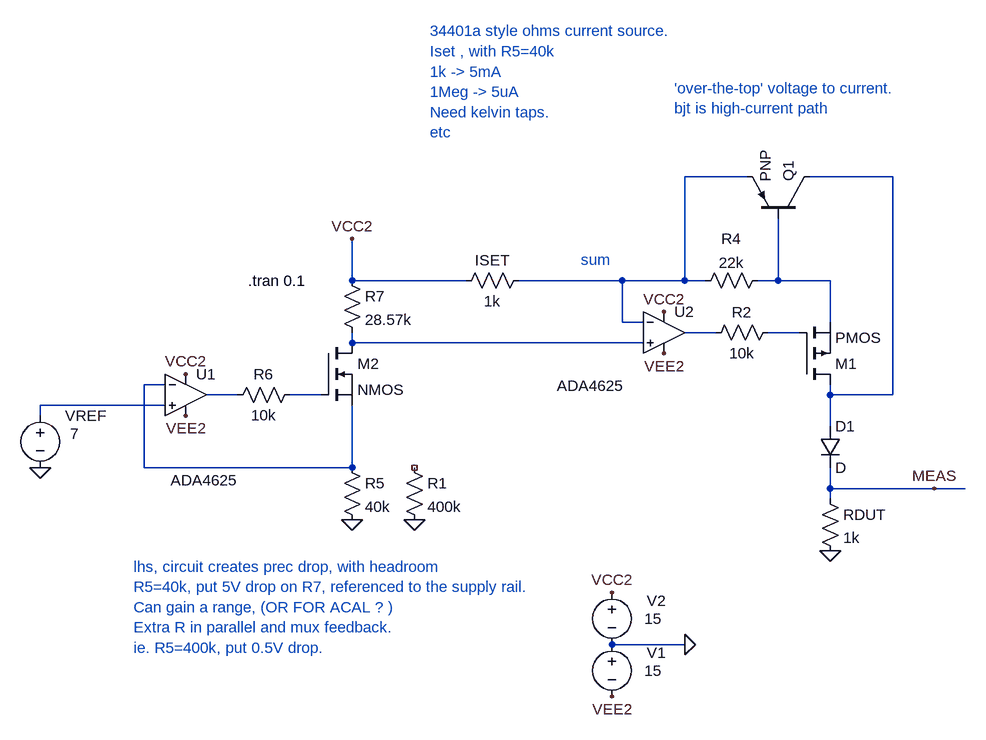
[diagram p0: schematic Draft16.asc]
Draft16.asc, the LTspice schematic file:
Version 4
SHEET 1 1768 872
WIRE 544 -144 448 -144
WIRE 768 -144 640 -144
WIRE -64 16 -64 -48
WIRE 112 16 -64 16
WIRE 352 16 192 16
WIRE 448 16 448 -144
WIRE 448 16 352 16
WIRE 480 16 448 16
WIRE 592 16 592 -80
WIRE 592 16 560 16
WIRE 672 16 592 16
WIRE 352 80 352 16
WIRE 384 80 352 80
WIRE 672 80 672 16
WIRE 496 96 448 96
WIRE 624 96 576 96
WIRE -64 112 -64 96
WIRE 384 112 -64 112
WIRE -64 128 -64 112
WIRE -352 176 -384 176
WIRE -240 192 -288 192
WIRE -112 192 -160 192
WIRE 672 192 672 176
WIRE 768 192 768 -144
WIRE 768 192 672 192
WIRE -352 208 -544 208
WIRE -544 224 -544 208
WIRE 672 240 672 192
WIRE -384 304 -384 176
WIRE -64 304 -64 208
WIRE -64 304 -384 304
WIRE 672 336 672 304
WIRE 832 336 672 336
WIRE 880 336 832 336
WIRE 672 352 672 336
WIRE 448 576 336 576
FLAG 448 576 0
FLAG 336 656 VEE2
FLAG 336 496 VCC2
FLAG 416 128 VEE2
FLAG 416 64 VCC2
FLAG -320 224 VEE2
FLAG -320 160 VCC2
FLAG -544 304 0
FLAG -64 384 0
FLAG -64 -48 VCC2
FLAG 672 432 0
FLAG 832 336 MEAS
FLAG 32 384 0
SYMBOL voltage 336 560 R0
WINDOW 0 54 29 Left 2
WINDOW 3 50 56 Left 2
WINDOW 123 0 0 Left 0
WINDOW 39 0 0 Left 0
SYMATTR InstName V1
SYMATTR Value 15
SYMBOL res 656 336 R0
SYMATTR InstName RDUT
SYMATTR Value 1k
SYMBOL res 208 0 R90
WINDOW 0 0 56 VBottom 2
WINDOW 3 32 56 VTop 2
SYMATTR InstName ISET
SYMATTR Value 1k
SYMBOL pmos 624 176 M180
SYMATTR InstName M1
SYMBOL voltage 336 480 R0
WINDOW 0 54 29 Left 2
WINDOW 3 50 56 Left 2
WINDOW 123 0 0 Left 0
WINDOW 39 0 0 Left 0
SYMATTR InstName V2
SYMATTR Value 15
SYMBOL res 592 80 R90
WINDOW 0 0 56 VBottom 2
WINDOW 3 32 56 VTop 2
SYMATTR InstName R2
SYMATTR Value 10k
SYMBOL res 576 0 R90
WINDOW 0 -33 56 VBottom 2
WINDOW 3 -27 56 VTop 2
SYMATTR InstName R4
SYMATTR Value 22k
SYMBOL pnp 640 -80 M270
SYMATTR InstName Q1
SYMBOL OpAmps\\ADA4625 416 32 R0
WINDOW 3 -165 146 Left 2
SYMATTR InstName U2
SYMBOL diode 656 240 R0
SYMATTR InstName D1
SYMBOL res -80 288 R0
SYMATTR InstName R5
SYMATTR Value 40k
SYMBOL res -144 176 R90
WINDOW 0 0 56 VBottom 2
WINDOW 3 32 56 VTop 2
SYMATTR InstName R6
SYMATTR Value 10k
SYMBOL OpAmps\\ADA4625 -320 128 R0
WINDOW 3 -23 195 Left 2
SYMATTR InstName U1
SYMBOL voltage -544 208 R0
WINDOW 123 0 0 Left 0
WINDOW 39 0 0 Left 0
WINDOW 3 46 44 Left 2
WINDOW 0 38 16 Left 2
SYMATTR Value 7
SYMATTR InstName VREF
SYMBOL res -80 0 R0
SYMATTR InstName R7
SYMATTR Value 28.57k
SYMBOL nmos -112 112 R0
SYMATTR InstName M2
SYMBOL res 16 288 R0
SYMATTR InstName R1
SYMATTR Value 400k
TEXT -224 16 Left 2 !.tran 0.1
TEXT -400 456 Left 2 ;lhs, circuit creates prec drop, with headroom\nR5=40k, put 5V drop on R7, referenced to the supply rail.\nCan gain a range, (OR FOR ACAL ? )\nExtra R in parallel and mux feedback.\nie. R5=400k, put 0.5V drop.
TEXT 432 -280 Left 2 ;'over-the-top' voltage to current.\nbjt is high-current path
TEXT 56 -368 Left 2 ;34401a style ohms current source.\nIset , with R5=40k\n1k -> 5mA\n1Meg -> 5uA\nNeed kelvin taps.\netc
TEXT 288 -16 Left 2 ;sum

The netlist it stands for:
* Draft16.asc
V1 0 VEE2 15
RDUT MEAS 0 1k
R§ISET N001 VCC2 1k
M1 N002 N005 N003 N003 PMOS
V2 VCC2 0 15
R2 N005 N004 10k
R4 N003 N001 22k
Q1 N002 N003 N001 0 PNP
XU2 N006 N001 VCC2 VEE2 N004 ADA4625  ; pins In+ In- V+ V- OUT
D1 N002 MEAS D
R5 N007 0 40k
R6 N009 N008 10k
XU1 N010 N007 VCC2 VEE2 N008 ADA4625  ; pins In+ In- V+ V- OUT
VREF N010 0 7
R7 VCC2 N006 28.57k
M2 N006 N009 N007 N007 NMOS
R1 NC_01 0 400k
.model D D
.lib standard.dio
.model NPN NPN
.model PNP PNP
.lib standard.bjt
.model NMOS NMOS
.model PMOS PMOS
.lib standard.mos
.tran 0.1
* lhs, circuit creates prec drop, with headroom
* R5=40k, put 5V drop on R7, referenced to the supply rail.
* Can gain a range, (OR FOR ACAL ? )
* Extra R in parallel and mux feedback.
* ie. R5=400k, put 0.5V drop.
* 'over-the-top' voltage to current.
* bjt is high-current path
* 34401a style ohms current source.
* Iset , with R5=40k
* 1k -> 5mA
* 1Meg -> 5uA
* Need kelvin taps.
* etc
* sum
.backanno
.end